# Altium schematic sheet main.SchDoc
size A4; SheetNumber: 1; SheetTotal: 7
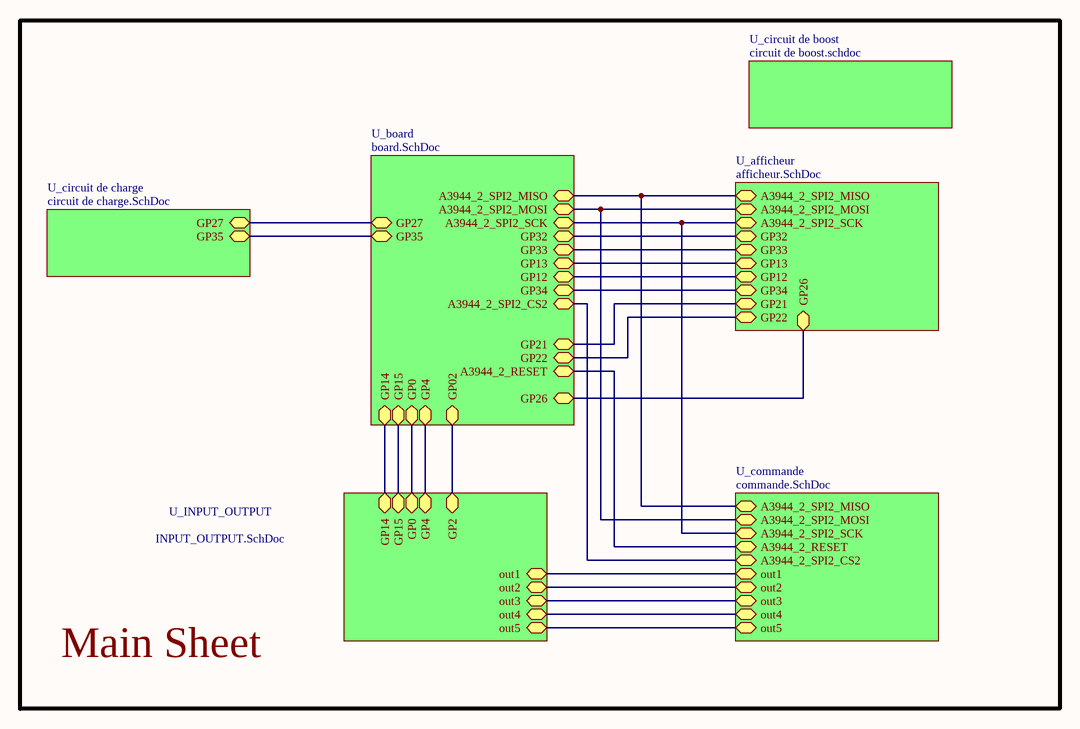
[diagram p0: main.SchDoc]

## Sub-sheets
U_afficheur = afficheur.SchDoc: A3944_2_SPI2_MISO (bidir), A3944_2_SPI2_MOSI (bidir), A3944_2_SPI2_SCK (bidir), GP32 (bidir), GP33 (bidir), GP13 (bidir), GP12 (bidir), GP34 (bidir), GP21 (bidir), GP22 (bidir), GP26 (bidir)
U_board = board.SchDoc: A3944_2_SPI2_MOSI (bidir), GP22 (bidir), GP21 (bidir), A3944_2_SPI2_CS2 (bidir), GP27 (bidir), A3944_2_SPI2_MISO (bidir), A3944_2_SPI2_SCK (bidir), GP4 (bidir), GP0 (bidir), GP14 (bidir), A3944_2_RESET (bidir), GP33 (bidir), GP32 (bidir), GP34 (bidir), GP12 (bidir), GP13 (bidir), GP02 (bidir), GP15 (bidir), GP35 (bidir), GP26 (bidir)
U_circuit de boost = circuit de boost.schdoc: no entries
U_circuit de charge = circuit de charge.SchDoc: GP27 (bidir), GP35 (bidir)
U_commande = commande.SchDoc: A3944_2_RESET (bidir), A3944_2_SPI2_MISO (bidir), A3944_2_SPI2_SCK (bidir), A3944_2_SPI2_MOSI (bidir), A3944_2_SPI2_CS2 (bidir), out1 (bidir), out2 (bidir), out3 (bidir), out4 (bidir), out5 (bidir)
U_INPUT_OUTPUT = INPUT_OUTPUT.SchDoc: GP15 (bidir), GP14 (bidir), GP4 (bidir), GP0 (bidir), out1 (bidir), out2 (bidir), out3 (bidir), out4 (bidir), out5 (bidir), GP2 (bidir)

## Nets
(unnamed): sheet U_board/A3944_2_SPI2_MOSI, sheet U_commande/A3944_2_SPI2_MOSI, sheet U_afficheur/A3944_2_SPI2_MOSI
(unnamed): sheet U_board/GP22, sheet U_afficheur/GP22
(unnamed): sheet U_board/GP21, sheet U_afficheur/GP21
(unnamed): sheet U_board/A3944_2_SPI2_CS2, sheet U_commande/A3944_2_SPI2_CS2
(unnamed): sheet U_board/GP27, sheet U_circuit de charge/GP27
(unnamed): sheet U_board/A3944_2_SPI2_MISO, sheet U_commande/A3944_2_SPI2_MISO, sheet U_afficheur/A3944_2_SPI2_MISO
(unnamed): sheet U_board/A3944_2_SPI2_SCK, sheet U_commande/A3944_2_SPI2_SCK, sheet U_afficheur/A3944_2_SPI2_SCK
(unnamed): sheet U_board/GP4, sheet U_INPUT_OUTPUT/GP4
(unnamed): sheet U_board/GP0, sheet U_INPUT_OUTPUT/GP0
(unnamed): sheet U_board/GP14, sheet U_INPUT_OUTPUT/GP14
(unnamed): sheet U_board/A3944_2_RESET, sheet U_commande/A3944_2_RESET
(unnamed): sheet U_board/GP33, sheet U_afficheur/GP33
(unnamed): sheet U_board/GP32, sheet U_afficheur/GP32
(unnamed): sheet U_board/GP34, sheet U_afficheur/GP34
(unnamed): sheet U_board/GP12, sheet U_afficheur/GP12
(unnamed): sheet U_board/GP13, sheet U_afficheur/GP13
(unnamed): sheet U_board/GP02, sheet U_INPUT_OUTPUT/GP2
(unnamed): sheet U_board/GP15, sheet U_INPUT_OUTPUT/GP15
(unnamed): sheet U_board/GP35, sheet U_circuit de charge/GP35
(unnamed): sheet U_board/GP26, sheet U_afficheur/GP26
(unnamed): sheet U_INPUT_OUTPUT/out1, sheet U_commande/out1
(unnamed): sheet U_INPUT_OUTPUT/out2, sheet U_commande/out2
(unnamed): sheet U_INPUT_OUTPUT/out3, sheet U_commande/out3
(unnamed): sheet U_INPUT_OUTPUT/out4, sheet U_commande/out4
(unnamed): sheet U_INPUT_OUTPUT/out5, sheet U_commande/out5

## Notes on the sheet
- Labels drawn without touching a wire or pin: Main Sheet